# Altium schematic sheet Shematics.SchDoc: Wiring Shematics
size Letter; ApprovedBy: APPROUVÉ PAR; Author: Javier Bolduc; Organization: Cegep Limoilou; Address1: 1300, 8e Avenue; Address2: Québec, QC; Address3: Canada; Address4: G1J 5L5; Revision: A; SheetNumber: 1; SheetTotal: 1
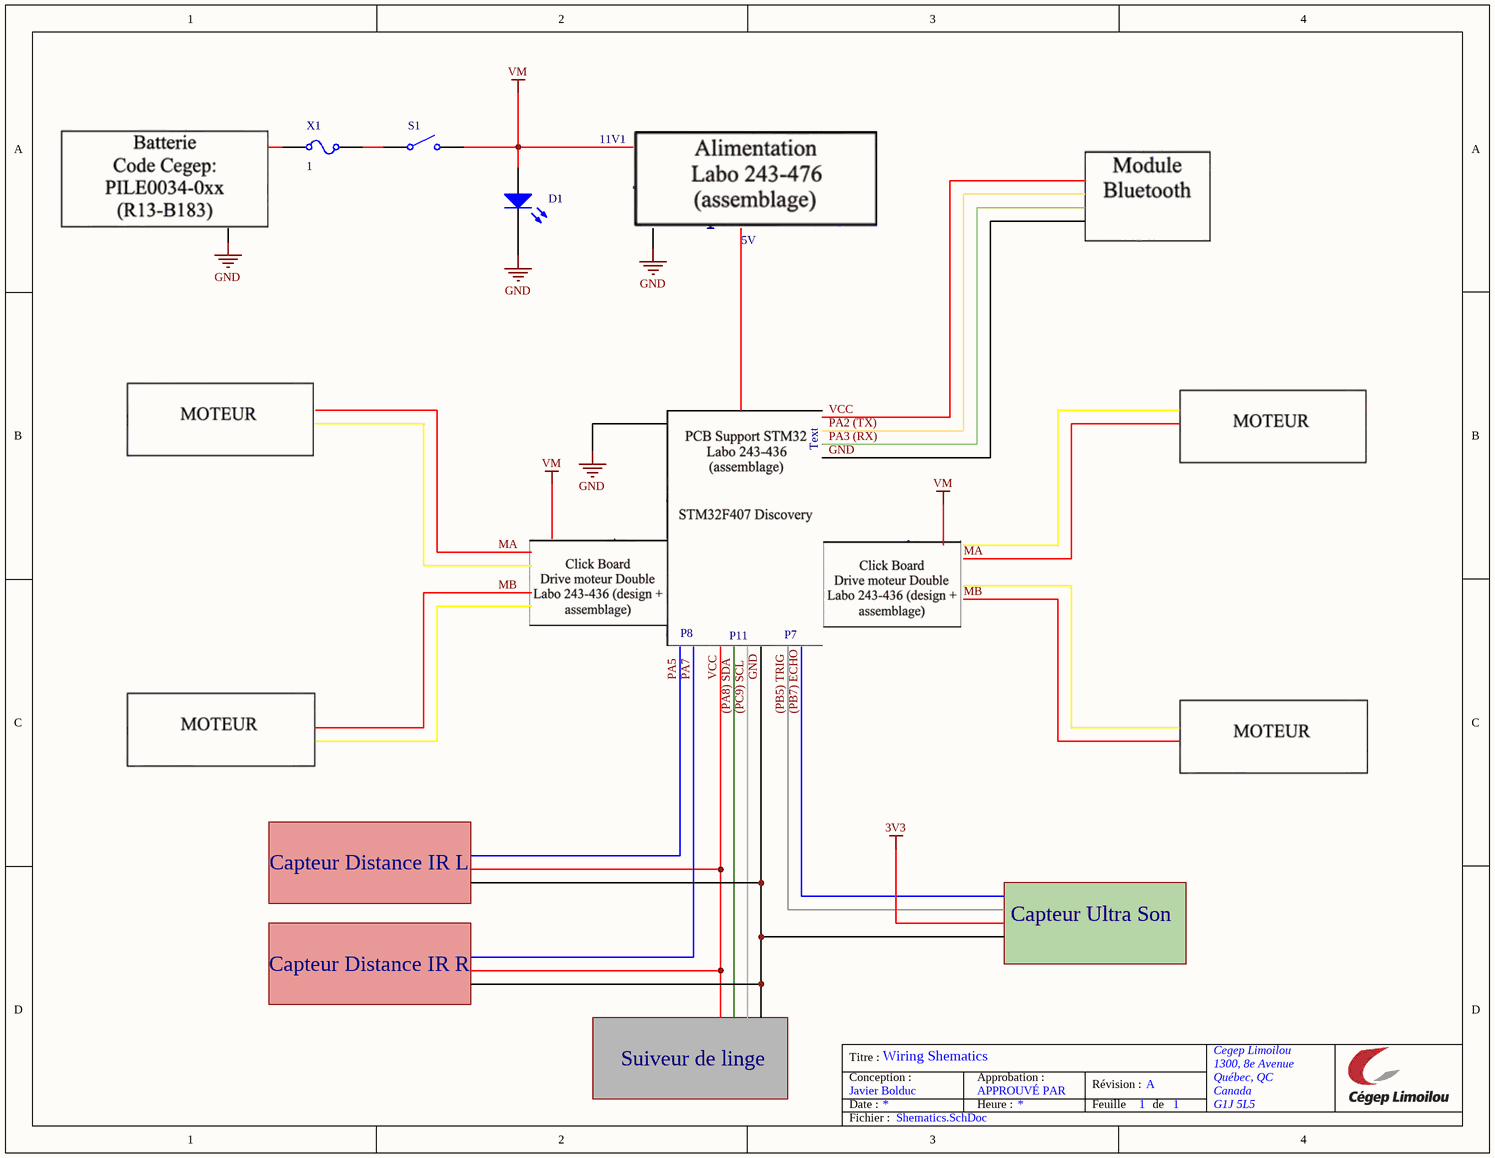
[diagram p0: Shematics.SchDoc]

## Parts
D1  Light-Emitting Diode  (value not drawn)
S1  Single-Pole, Single-Throw Switch  (value not drawn)
X1  CURRENT: 1  (hidden comment: Fuse)

## Nets
GND: D1.2(K)
VM: D1.1(A) S1.2
NetS1_1: S1.1 X1.2

Not connected (* = marked no-connect by the designer): X1 1

## Notes on the sheet
- 11V1
- 5V
- Text
- P8
- P11
- P7
- Capteur Distance IR L
- Capteur Ultra Son
- Capteur Distance IR R
- Suiveur de linge
- Titre :
- Conception :
- Date :
- Approbation :
- Heure :
- Révision :
- Feuille
- de
- Fichier :

## Library data of the parts
D1 = LED: AF: 1; BV: 0; BV_MAX: 1e99; EG: 1.11; FC: 0.5; IBV: 0.001; IS: 1e-14; MJSW: 0.33; NTUN: 30; TNOM: 27; XTI: 3; SimulationGenericComponent: True; CJO: 0; CJP: 0; CTA: 0; CTP: 0; FCS: 0.5; FV_MAX: 1e99; IKF: 0; IKR: 0; ISR: 1e-14; JSW: 0; JTUN: 0; JTUNSW: 0; KEG: 1; KF: 0; LEVEL: 1; N: 1; NBV: 1; NR: 1; NS: 1; PHP: 1; RS: 0; TCV: 0; TLEV: 0; TLEVC: 0; TM1: 0; TM2: 0; TPB: 0; TPHP: 0; TRS: 0; TRS2: 0; TT: 0; TTT1: 0; TTT2: 0; VJ: 1; XTITUN: 3
S1 = SPST SW: closed: 0; Rclosed: 1m; Ropen: 1Meg; SimulationGenericComponent: True
X1 = Fuse: RESISTANCE: 1m; SimulationGenericComponent: True